# Altium schematic sheet SCH.SchDoc
size A3; SheetNumber: 1; SheetTotal: 1
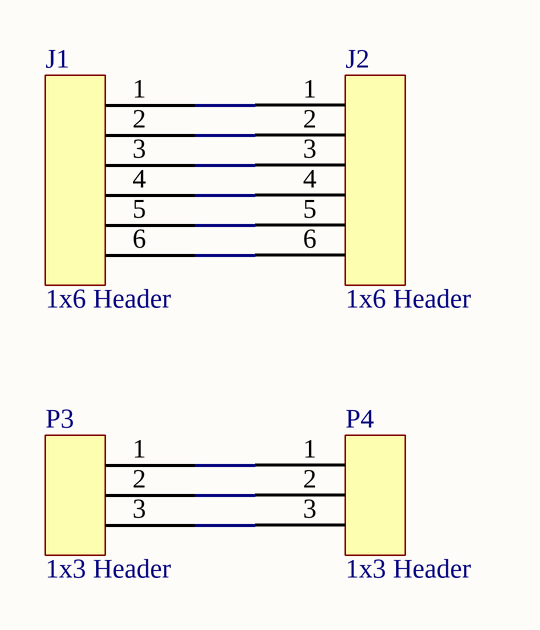
[diagram p0: SCH.SchDoc]

## Parts
J1  1x6 Header  [1x6 Header 1.27]
J2  1x6 Header  [1x6 Header 1.27]
P3  1x3 Header  [1x3 Header 1.27]
P4  1x3 Header  [1x3 Header 1.27]

## Nets
NetJ1_1: J1.1 J2.1
NetJ1_2: J1.2 J2.2
NetJ1_3: J1.3 J2.3
NetJ1_4: J1.4 J2.4
NetJ1_5: J1.5 J2.5
NetJ1_6: J1.6 J2.6
NetP3_1: P3.1 P4.1
NetP3_2: P3.2 P4.2
NetP3_3: P3.3 P4.3